# EAGLE design Danger_Shield-v16 (EAGLE 5.09)
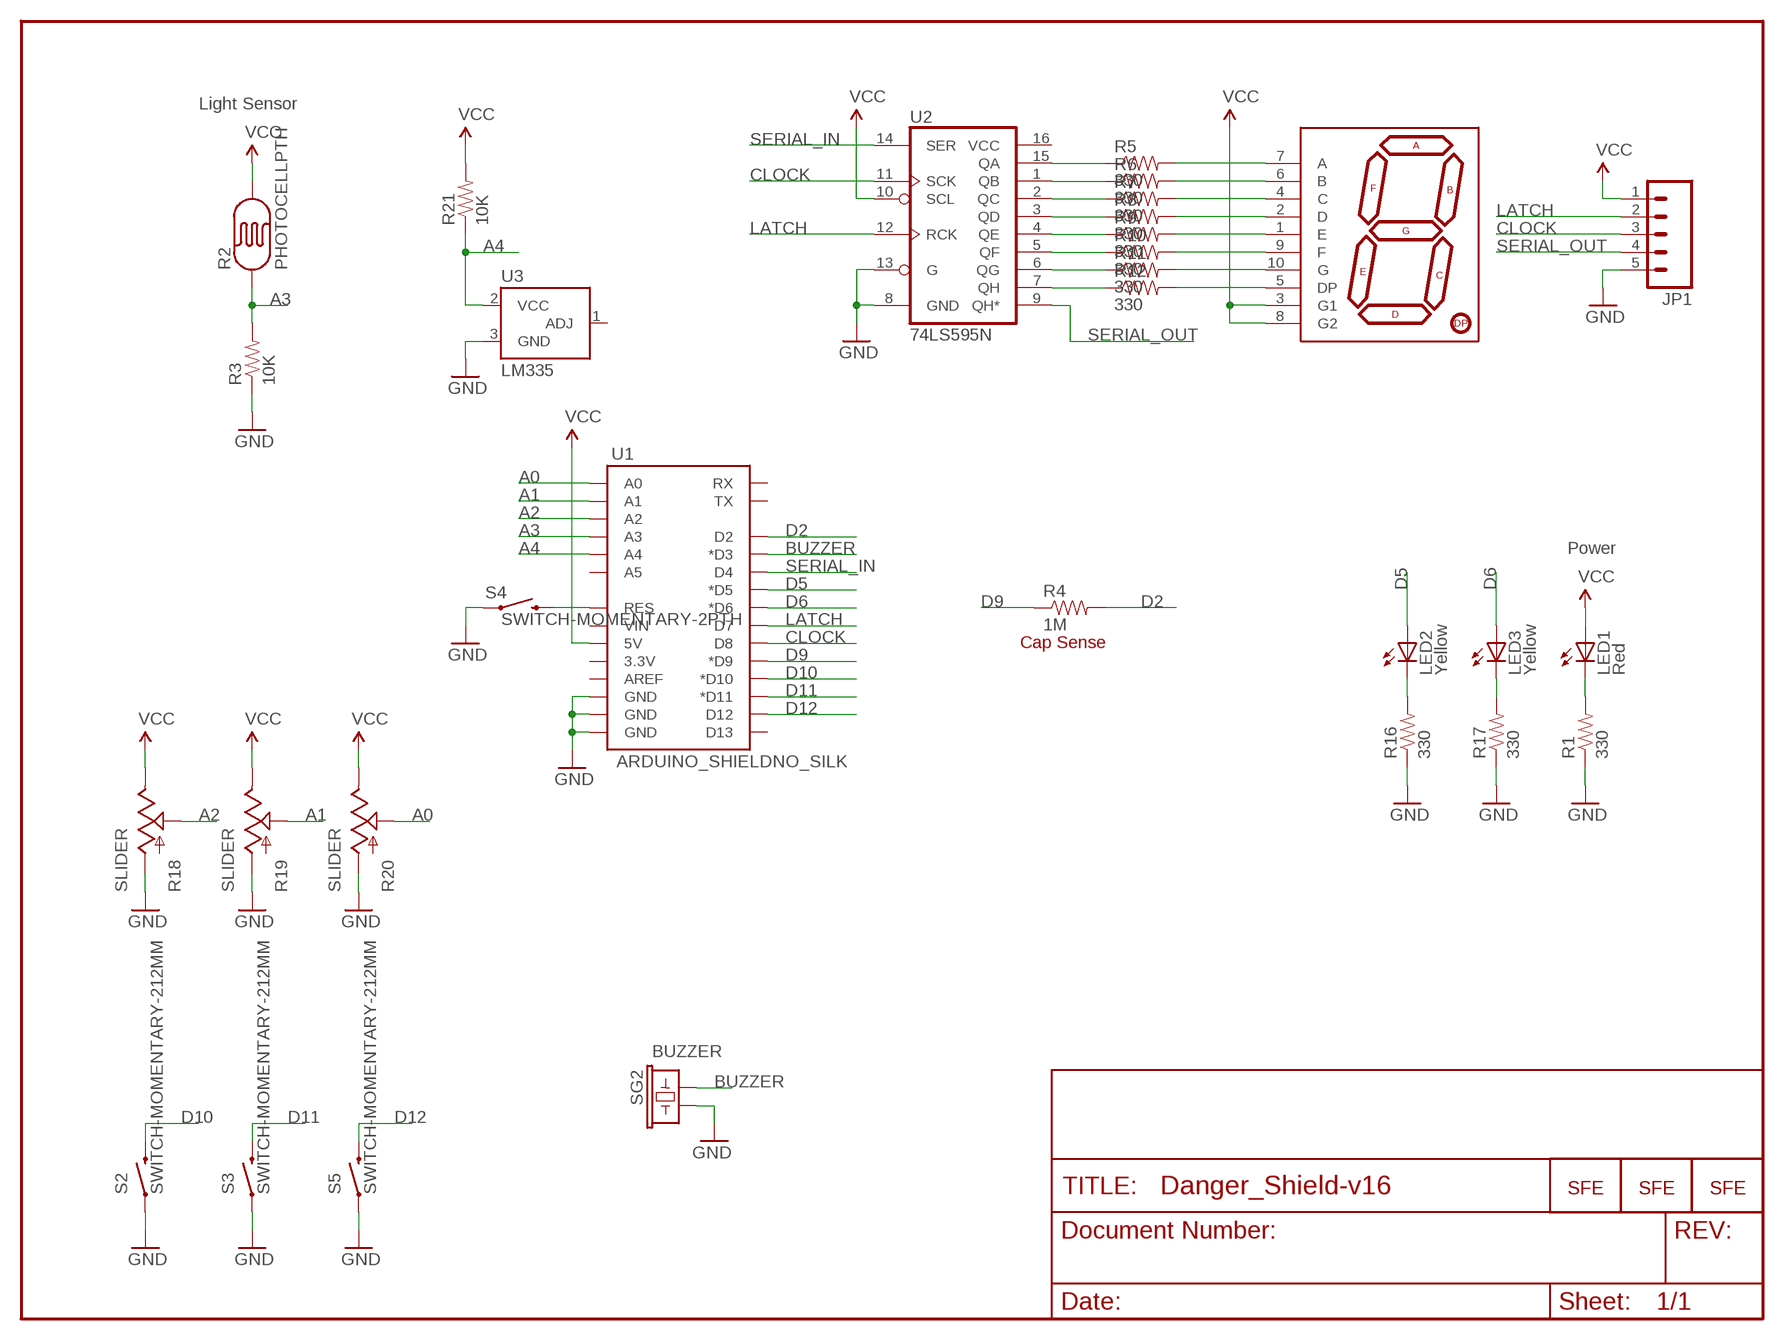
[diagram p0: schematic, sheet 1]

## Parts
JP1  M05PTH  [1X05]
JP2  LOGO-SFENEW  [SFE-NEW-WEBLOGO]
JP3  LOGO-SFENEW  [SFE-NEW-WEBLOGO]
JP5  LOGO-SFESK  [SFE-LOGO-FLAME]
LED1  Red  LED5MM  [LED5MM]
LED2  Yellow  LED5MM  [LED5MM]
LED3  Yellow  LED5MM  [LED5MM]
R1  330  RESISTORAXIAL-0.3  [AXIAL-0.3]
R2  PHOTOCELLPTH  [PHOTOCELL]
R3  10K  RESISTORAXIAL-0.3  [AXIAL-0.3]
R4  1M  RESISTORAXIAL-0.3  [AXIAL-0.3]
R5  330  RESISTORAXIAL-0.3  [AXIAL-0.3]
R6  330  RESISTORAXIAL-0.3  [AXIAL-0.3]
R7  330  RESISTORAXIAL-0.3  [AXIAL-0.3]
R8  330  RESISTORAXIAL-0.3  [AXIAL-0.3]
R9  330  RESISTORAXIAL-0.3  [AXIAL-0.3]
R10  330  RESISTORAXIAL-0.3  [AXIAL-0.3]
R11  330  RESISTORAXIAL-0.3  [AXIAL-0.3]
R12  330  RESISTORAXIAL-0.3  [AXIAL-0.3]
R16  330  RESISTORAXIAL-0.3  [AXIAL-0.3]
R17  330  RESISTORAXIAL-0.3  [AXIAL-0.3]
R18  SLIDER  [SLIDER]
R19  SLIDER  [SLIDER]
R20  SLIDER  [SLIDER]
R21  10K  RESISTORAXIAL-0.3  [AXIAL-0.3]
S2  SWITCH-MOMENTARY-212MM  [TACTILE-PTH-12MM]
S3  SWITCH-MOMENTARY-212MM  [TACTILE-PTH-12MM]
S4  SWITCH-MOMENTARY-2PTH  [TACTILE-PTH]
S5  SWITCH-MOMENTARY-212MM  [TACTILE-PTH-12MM]
SG2  BUZZER  BUZZERPTH  [BUZZER-12MM]
U1  ARDUINO_SHIELDNO_SILK  [DUEMILANOVE_VIAS]
U2  74LS595N  [DIL16]
U3  LM335  TEMPERATURE-SENSOR  [TO-92]
U$6  7-SEGMENT-DISPLAY-1"-RED  [7-SEGMENT-1"PTH]

## Nets
A0: R20.2A(S) U1.A0
A1: R19.2A(S) U1.A1
A2: R18.2A(S) U1.A2
A3: R2.1 R3.P$2 U1.A3
A4: R21.P$1 U1.A4 U3.2(VCC)
BUZZER: SG2.+ U1.D3(*D3)
CLOCK: JP1.3 U1.D8 U2.11(SCK)
D2: R4.P$2 U1.D2
D5: LED2.A U1.D5(*D5)
D6: LED3.A U1.D6(*D6)
D9: R4.P$1 U1.D9(*D9)
D10: S2.3 U1.D10(*D10)
D11: S3.3 U1.D11(*D11)
D12: S5.3 U1.D12
GND: JP1.5 R1.P$1 R3.P$1 R16.P$1 R17.P$1 R18.3(A) R19.3(A) R20.3(A) S2.1 S3.1 S4.1 S5.1 SG2.- U1.GND@0(GND) U1.GND@1(GND) U1.GND@2(GND) U2.8(GND) U2.13(G) U3.3(GND)
LATCH: JP1.2 U1.D7 U2.12(RCK)
N$1: S4.3 U1.RES
N$2: R5.P$1 U2.15(QA)
N$3: LED1.K(C) R1.P$2
N$4: R6.P$1 U2.1(QB)
N$5: R7.P$1 U2.2(QC)
N$6: R8.P$1 U2.3(QD)
N$7: R9.P$1 U2.4(QE)
N$8: R10.P$1 U2.5(QF)
N$9: R11.P$1 U2.6(QG)
N$10: R12.P$1 U2.7(QH)
N$11: R5.P$2 U$6.7(A)
N$12: R6.P$2 U$6.6(B)
N$13: R7.P$2 U$6.4(C)
N$14: R8.P$2 U$6.2(D)
N$15: R9.P$2 U$6.1(E)
N$16: R10.P$2 U$6.9(F)
N$17: R11.P$2 U$6.10(G)
N$18: R12.P$2 U$6.5(DP)
N$19: LED3.K(C) R17.P$2
N$20: LED2.K(C) R16.P$2
SERIAL_IN: U1.D4 U2.14(SER)
SERIAL_OUT: JP1.4 U2.9(QH*)
VCC: JP1.1 LED1.A R2.2 R18.1(E) R19.1(E) R20.1(E) R21.P$2 U1.5V U2.10(SCL) U$6.3(G1) U$6.8(G2)
Unconnected: U1.3.3V U1.A5 U1.AREF U1.D13 U1.RX U1.TX U1.VIN U3.1(ADJ)

## Notes on the sheet
- Light Sensor
- Power
- Cap Sense

## Power pins joined to a net without a drawn wire
VCC: U2.16(VCC)

## Library data of the parts
JP1 = SparkFun:M05: Header 5 Standard 5-pin 0.1" header. Use with straight break away headers (SKU : PRT-00116), right angle break away headers (PRT-00553), swiss pins (PRT-00743), machine pins (PRT-00117), and female headers (PRT-00115). Molex polarized connector foot print use with SKU : PRT-08230 with associated crimp pins and housings.
JP2 JP3 JP5 = SparkFun:LOGO-SFE: Spark Fun Electronics PCB Logo This is the standard Spark Fun Electronics PCB logo.
LED1-LED3 = SparkFun:LED: LEDs Standard schematic elements and footprints for 5mm, 3mm, 1206, and 0603 sized LEDs. 5mm - Spark Fun Electronics SKU : COM-00529 (and others)
R1 R3-R12 R16 R17 R21 = SparkFun:RESISTOR: Resistor Basic schematic elements and footprints for 0603, 1206, and PTH resistors.
R2 = SparkFun:PHOTOCELL: Photocell Also known as a CdS photoresistor. This is a low cost way to detect light levels. Resistance decreases with more incoming light. SparkFun SKU: SEN-09088
R18-R20 = SparkFun:SLIDER
S2-S5 = SparkFun:SWITCH-MOMENTARY-2
SG2 = SparkFun:BUZZER: Buzzer 12mm Spark Fun Electronics SKU : Comp-Buzzer
U1 = SparkFun:ARDUINO_SHIELD
U2 = SparkFun:74*595: 8-bit SHIFT REGISTER, output latch
U3 = SparkFun:TEMPERATURE-SENSOR
U$6 = SparkFun:7-SEGMENT-DISPLAY-1"-RED: 7-Segment Display 1" Red (COM-08546)

## Board
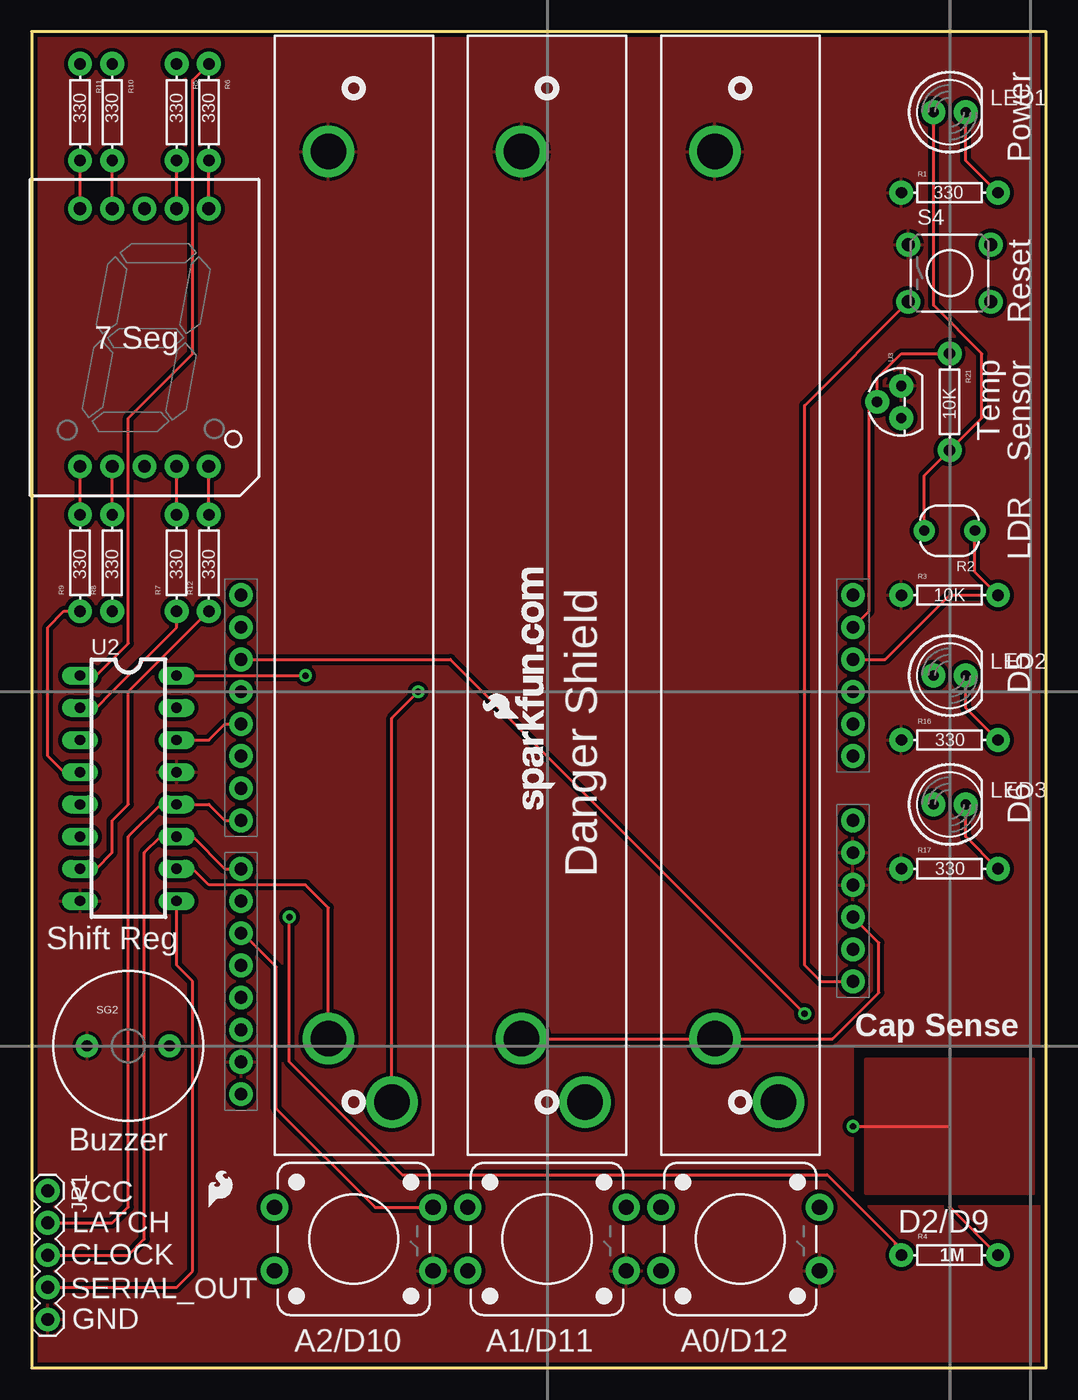
[diagram p1: board, top side]
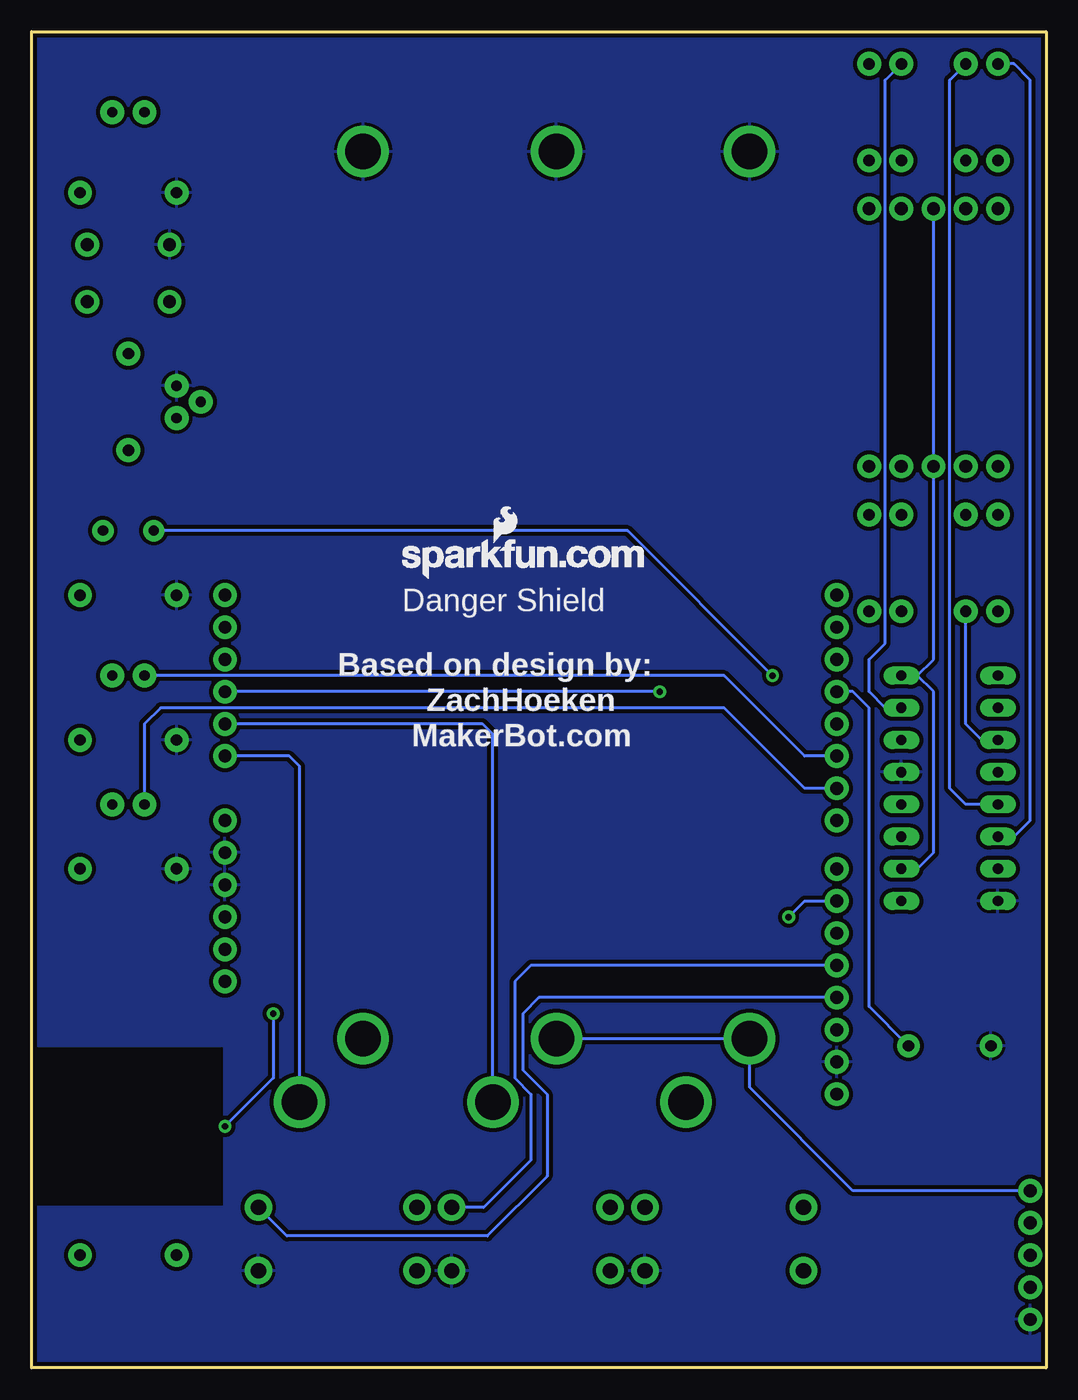
[diagram p2: board, bottom side, seen from below]

Size 80.01 x 105.41 mm. Coordinates in mm from the lower left corner, seen from the top.
Outline: 0,0 80.01,0 80.01,105.41 0,105.41 0,0
Copper layers (1*16): Top 0.035mm / dielectric 1.5mm / Bottom 0.035mm
Design rules "SparkFun *": minimum track width 8mil, minimum drill 20mil, track to track 8mil, track to pad 8mil, pad to pad 8mil, via to via 8mil, smd to smd 8mil, copper to edge 8mil, drill to drill 8mil, minimum pad ring 12mil, minimum via ring 10mil, stop-mask expansion 4mil, vias tented up to drill 20mil, thermal gap 10mil

### Footprints (pad centres in the part's own frame; a part is rotated, then mirrored left to right if it is on the bottom)
1X05 = drill 1.016 pad 1.88 round: 1 0,0; 2 2.54,0; 3 5.08,0; 4 7.62,0; 5 10.16,0
LED5MM = drill 0.813 pad 1.88 round: A -1.27,0; K 1.27,0
AXIAL-0.3 = drill 0.9 pad 1.88 round: P$1 -3.81,0; P$2 3.81,0
PHOTOCELL = drill 0.8 pad 1.676 round: 1 -2,0; 2 2,0
SLIDER = drill 2.8 pad 4.064 round: 1 -35,2; 2A -40,-3; 3 35,2
TACTILE-PTH-12MM = drill 1.2 pad 2.159 round: 1 6.25,-2.5; 2 -6.25,-2.5; 3 6.25,2.5; 4 -6.25,2.5
TACTILE-PTH = drill 1.016 pad 1.88 round: 1 -3.251,2.261; 2 3.251,2.261; 3 -3.251,-2.261; 4 3.251,-2.261
BUZZER-12MM = drill 0.9 pad 1.778 round: + 3.25,0; - -3.25,0
DUEMILANOVE_VIAS = drill 1.016 pad 1.88 round: 3.3V 50.8,13.97; 5V 50.8,16.51; A0 50.8,29.21; A1 50.8,31.75; A2 50.8,34.29; A3 50.8,36.83; A4 50.8,39.37; A5 50.8,41.91; AREF 2.54,2.54; D2 2.54,36.83; D3 2.54,34.29; D4 2.54,31.75; D5 2.54,29.21; D6 2.54,26.67; D7 2.54,24.13; D8 2.54,20.32; D9 2.54,17.78; D10 2.54,15.24; D11 2.54,12.7; D12 2.54,10.16; D13 2.54,7.62; GND@0 50.8,19.05; GND@1 50.8,21.59; GND@2 2.54,5.08; RES 50.8,11.43; RX 2.54,41.91; TX 2.54,39.37; VIN 50.8,24.13
DIL16 = drill 0.813 long: 1 -8.89,-3.81; 2 -6.35,-3.81; 3 -3.81,-3.81; 4 -1.27,-3.81; 5 1.27,-3.81; 6 3.81,-3.81; 7 6.35,-3.81; 8 8.89,-3.81; 9 8.89,3.81; 10 6.35,3.81; 11 3.81,3.81; 12 1.27,3.81; 13 -1.27,3.81; 14 -3.81,3.81; 15 -6.35,3.81; 16 -8.89,3.81
TO-92 = drill 0.813 pad 1.88 round: 1 -1.27,0; 2 0,1.905; 3 1.27,0
7-SEGMENT-1"PTH = drill 1 pad 1.88 round: 1 -5.08,-10.16; 2 -2.54,-10.16; 3 0,-10.16; 4 2.54,-10.16; 5 5.08,-10.16; 6 5.08,10.16; 7 2.54,10.16; 8 0,10.16; 9 -2.54,10.16; 10 -5.08,10.16

### Placement (x,y rotation side)
JP1  1.27,13.97 270 top
JP2  41.27,44.07 90 top
JP3  50.8,62.23 0 bottom
JP5  13.97,12.7 0 top
LED1  72.39,99.06 0 top
LED2  72.39,54.61 0 top
LED3  72.39,44.45 0 top
R1  72.39,92.71 0 top
R2  72.39,66.04 180 top
R3  72.39,60.96 0 top
R4  72.39,8.89 0 top
R5  11.43,99.06 270 top
R6  13.97,99.06 270 top
R7  11.43,63.5 90 top
R8  6.35,63.5 90 top
R9  3.81,63.5 90 top
R10  6.35,99.06 270 top
R11  3.81,99.06 270 top
R12  13.97,63.5 90 top
R16  72.39,49.53 0 top
R17  72.39,39.37 0 top
R18  25.4,60.96 90 top
R19  40.64,60.96 90 top
R20  55.88,60.96 90 top
R21  72.39,76.2 270 top
S2  25.4,10.16 0 top
S3  40.64,10.16 0 top
S4  72.39,86.36 0 top
S5  55.88,10.16 0 top
SG2  7.62,25.4 0 top
U1  13.97,19.05 0 top
U2  7.62,45.72 270 top
U3  68.58,76.2 90 top
U$6  8.89,81.28 0 top

### Tracks (layer width: path | path; a pad name or v marks a point on that pad's centre or on a via)
A0
  Bottom 0.254: R20.2A 58.88,47.45 59.69,48.26 U1.A0
A1
  Bottom 0.254: R19.2A 43.64,49.99 44.45,50.8 U1.A1
A2  (via drill 0.51)
  Top 0.254: R18.2A 28.4,51.26 v30.48,53.34
  Bottom 0.254: v30.48,53.34 U1.A2
A3
  Top 0.254: R2.1 74.39,62.77 R3.P$2 72.39,60.96 67.31,55.88 U1.A3
A4
  Top 0.254: U1.A4 66.04,59.69 66.04,75.56 U3.2 66.67,78.11 68.58,80.01 R21.P$1
BUZZER
  Bottom 0.254: U1.D3 15.24,53.34 13.97,52.07 13.97,28.5 SG2.+
CLOCK
  Top 0.254: U1.D8 15.24,39.37 12.7,41.91 U2.11 10.16,41.91 8.89,40.64 8.89,10.16 7.62,8.89 JP1.3
D2  (via drill 0.51)
  Top 0.254: U1.D2 33.02,55.88 v60.96,27.94 | v64.77,19.05 72.39,19.05 72.39,12.7 R4.P$2
  Bottom 0.254: v60.96,27.94 60.96,22.86 v64.77,19.05
  pour Top: 65.79,24.38 78.99,24.38 78.99,13.72 65.79,13.72
D5
  Bottom 0.254: LED2.A 25.4,54.61 19.05,48.26 U1.D5
D6
  Bottom 0.254: U1.D6 19.05,45.72 25.4,52.07 69.85,52.07 71.12,50.8 LED3.A
D9  (via drill 0.51)
  Top 0.254: 68.2,9.78 68.07,9.78 | 68.2,9.78 62.74,15.24 29.21,15.24 20.32,24.13 v20.32,35.56 | R4.P$1 68.58,9.4 68.2,9.78
  Bottom 0.254: v20.32,35.56 19.05,36.83 U1.D9
D10
  Top 0.254: S2.3 27.09,12.66 19.3,20.45 19.3,31.62 16.64,34.29 U1.D10
D11
  Bottom 0.254: U1.D11 40.64,31.75 41.91,30.48 41.91,22.86 40.64,21.59 40.64,16.38 44.36,12.66 S3.3
D12
  Bottom 0.254: U1.D12 40.01,29.21 41.27,27.94 41.27,23.5 39.37,21.59 39.37,15.11 44.07,10.41 59.88,10.41 S5.3
GND
  pour Top (isolate 0.305): 0,105.41 0,0 80.01,0 80.01,12.7 64.77,12.7 64.77,25.4 80.01,25.4 80.01,105.41
  pour Bottom (isolate 0.305): 0,105.41 0,0 80.01,0 80.01,12.7 64.77,12.7 64.77,25.4 80.01,25.4 80.01,105.41
LATCH
  Top 0.254: U1.D7 15.24,43.18 13.97,44.45 U2.12 10.16,44.45 7.62,41.91 7.62,12.7 6.35,11.43 JP1.2
N$1
  Top 0.254: U1.RES 62.23,30.48 60.96,31.75 60.96,75.92 S4.3
N$2
  Bottom 0.254: R5.P$1 12.7,101.6 12.7,57.15 13.97,55.88 13.97,53.34 12.7,52.07 U2.15
N$3
  Top 0.254: LED1.K 73.66,95.25 R1.P$2
N$4
  Top 0.254: R6.P$1 12.7,101.6 12.7,80.01 7.62,74.93 7.62,57.15 5.08,54.61 U2.1
N$5
  Top 0.254: U2.2 5.08,52.07 6.35,53.34 11.43,58.42 R7.P$1
N$6
  Bottom 0.254: U2.3 5.08,49.53 6.35,50.8 R8.P$1
N$7
  Top 0.254: R9.P$1 2.54,59.69 1.27,58.42 1.27,48.26 2.54,46.99 U2.4
N$8
  Bottom 0.254: R10.P$1 7.62,101.6 7.62,45.72 6.35,44.45 U2.5
N$9
  Bottom 0.254: R11.P$1 2.54,102.87 1.27,101.6 1.27,43.18 2.54,41.91 U2.6
N$10
  Top 0.254: R12.P$1 7.62,53.34 7.62,44.45 6.35,43.18 6.35,40.64 5.08,39.37 U2.7
N$11
  Top 0.254: U$6.7 R5.P$2
N$12
  Top 0.254: U$6.6 R6.P$2
N$13
  Top 0.254: R7.P$2 U$6.4
N$14
  Top 0.254: R8.P$2 U$6.2
N$15
  Top 0.254: R9.P$2 U$6.1
N$16
  Top 0.254: U$6.9 R10.P$2
N$17
  Top 0.254: U$6.10 R11.P$2
N$18
  Top 0.254: R12.P$2 U$6.5
N$19
  Top 0.254: LED3.K 73.66,41.91 R17.P$2
N$20
  Top 0.254: LED2.K 73.66,52.07 R16.P$2
SERIAL_IN
  Top 0.254: U2.14 13.97,49.53 15.24,50.8 U1.D4
SERIAL_OUT
  Top 0.254: U2.9 11.43,31.75 12.7,30.48 12.7,7.62 11.43,6.35 JP1.4
VCC  (via drill 0.51)
  Top 0.254: LED1.A 71.12,83.82 74.93,80.01 74.93,74.93 R21.P$2 70.39,70.39 R2.2 | R19.1 R20.1 63.17,25.96 66.8,29.59 66.8,33.53 U1.5V | U2.10 12.7,39.37 13.97,38.1 21.59,38.1 23.4,36.29 R18.1 | U2.16 v21.59,54.61
  Bottom 0.254: R19.1 R18.1 23.4,22.13 15.24,13.97 JP1.1 | 10.16,54.61 U2.16 | 10.16,54.61 8.89,53.34 8.89,40.64 10.16,39.37 U2.10 | v21.59,54.61 33.02,66.04 R2.2 | 10.16,54.61 8.89,55.88 U$6.3 U$6.8

### Text on the board
tPlace: Power | Reset | 7 Seg | Temp | Sensor | LDR | D5 | D6 | Danger Shield | Shift Reg | Cap Sense | Buzzer | VCC | LATCH | D2/D9 | CLOCK | SERIAL_OUT | GND | A2/D10 | A1/D11 | A0/D12
bPlace: Danger Shield | Based on design by: | ZachHoeken | MakerBot.com